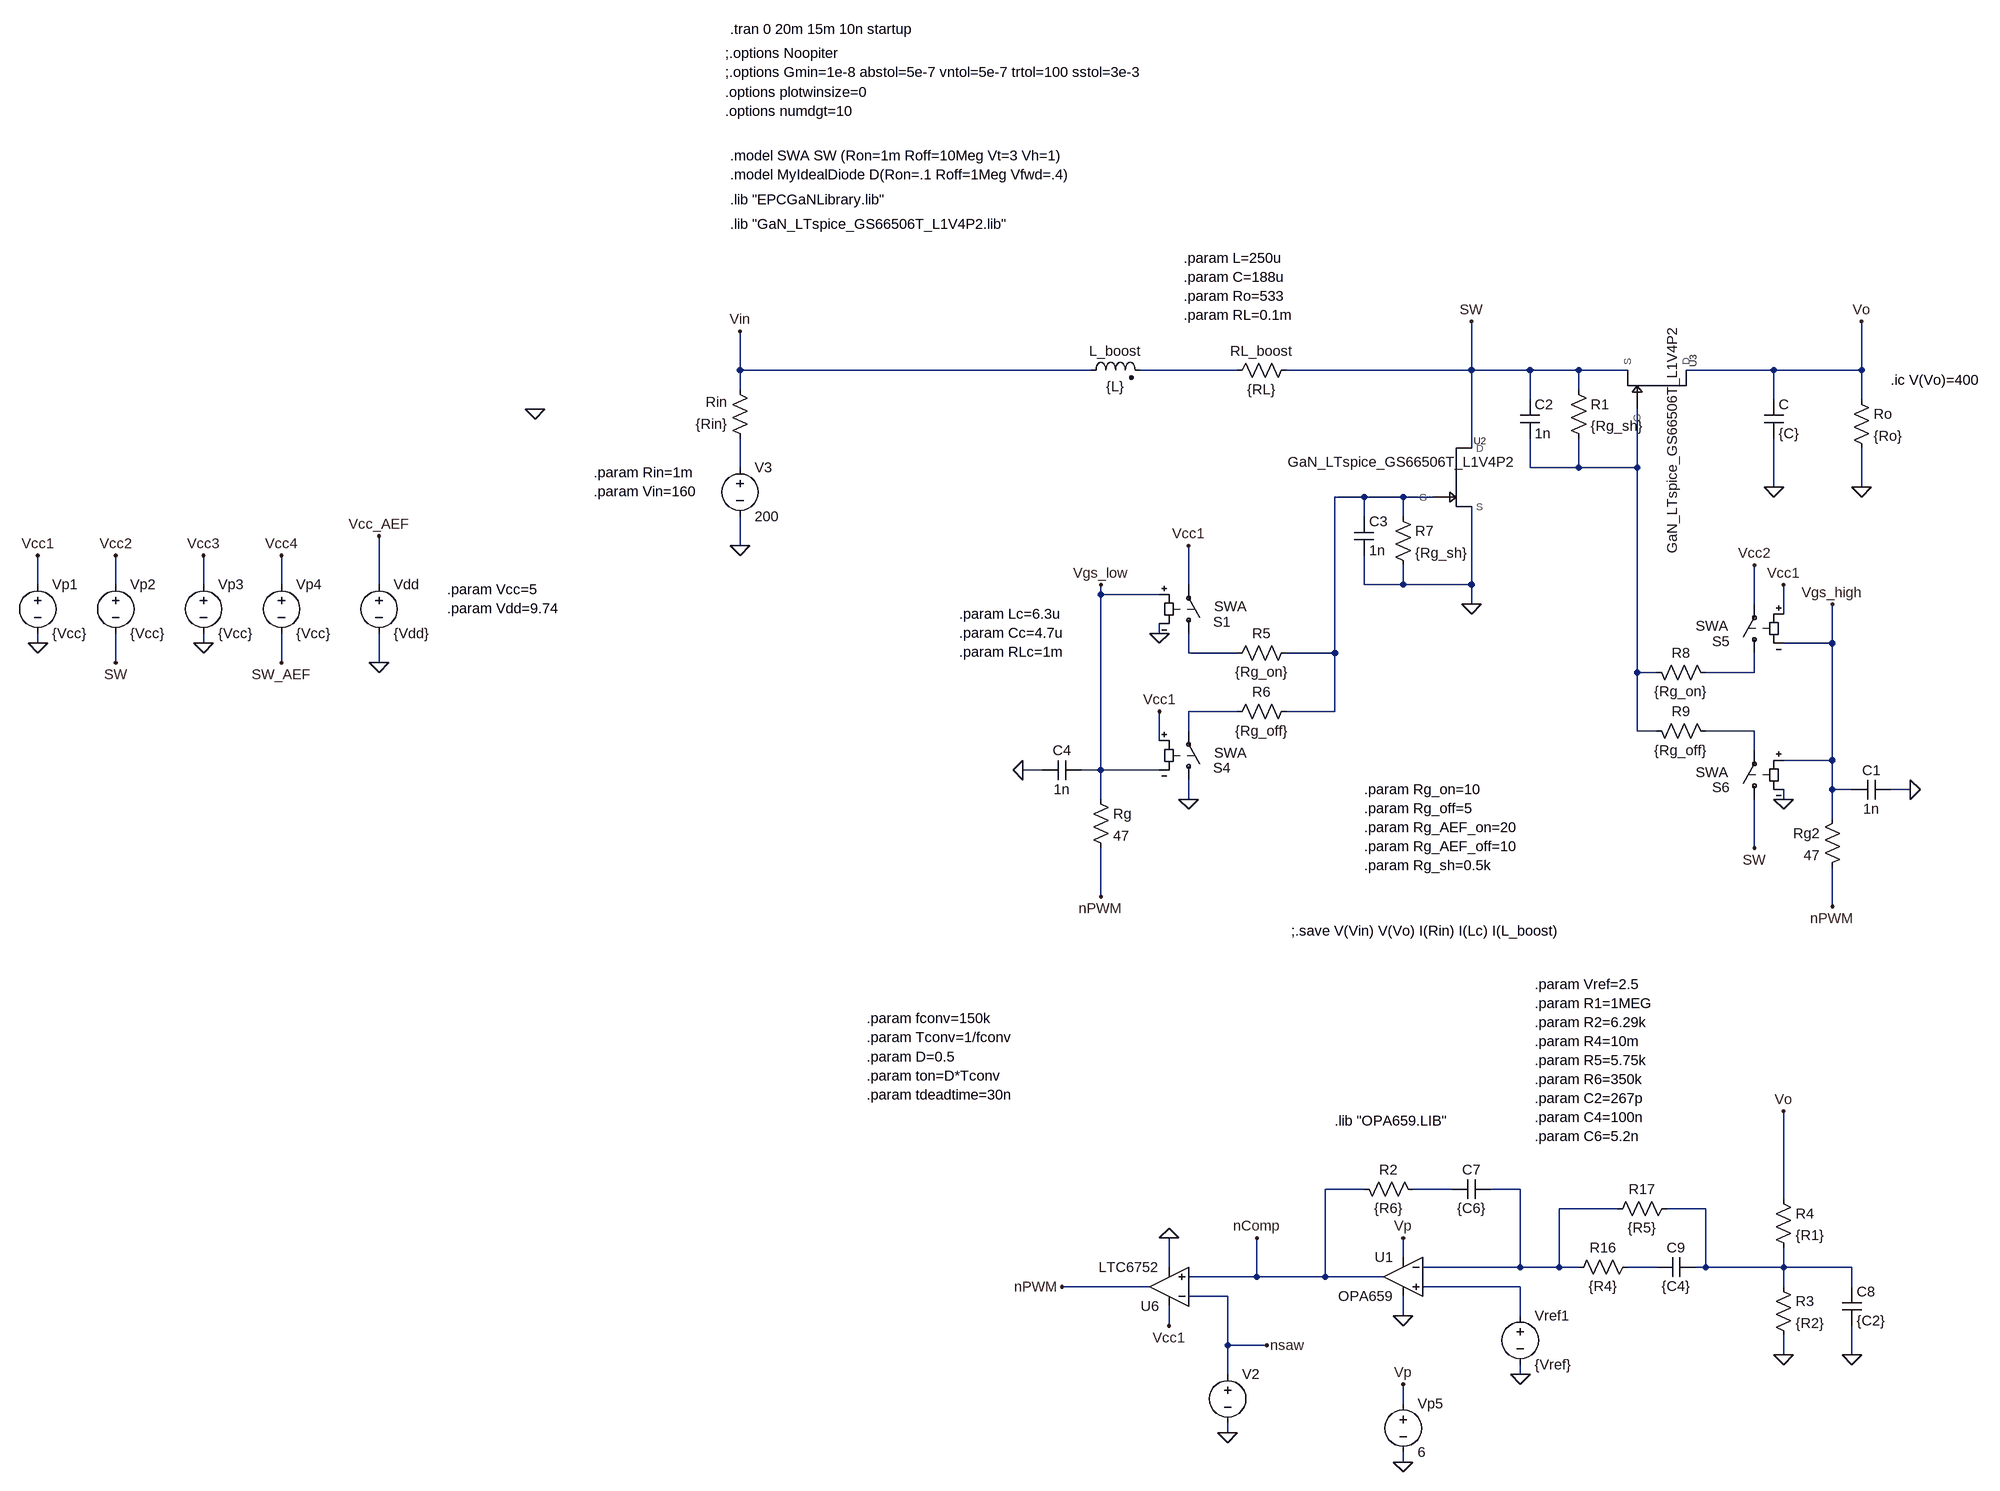
[diagram p0: schematic Boost converter with LC filter -20221025.asc]
Boost converter with LC filter -20221025.asc, the LTspice schematic file:
Version 4
SHEET 1 4440 3892
WIRE -1056 640 -1056 576
WIRE -480 640 -1056 640
WIRE -240 640 -400 640
WIRE 144 640 144 560
WIRE 144 640 -160 640
WIRE 240 640 144 640
WIRE 320 640 240 640
WIRE 400 640 320 640
WIRE 640 640 496 640
WIRE 784 640 784 560
WIRE 784 640 640 640
WIRE -1056 672 -1056 640
WIRE 320 672 320 640
WIRE 240 688 240 640
WIRE 640 688 640 640
WIRE 784 688 784 640
WIRE 144 768 144 640
WIRE -1056 800 -1056 752
WIRE 240 800 240 752
WIRE 320 800 320 752
WIRE 320 800 240 800
WIRE 416 800 416 704
WIRE 416 800 320 800
WIRE 640 832 640 752
WIRE 784 832 784 768
WIRE -32 848 -80 848
WIRE 32 848 -32 848
WIRE 80 848 32 848
WIRE -32 880 -32 848
WIRE 32 880 32 848
WIRE -1056 928 -1056 880
WIRE -2208 992 -2208 944
WIRE -2080 992 -2080 944
WIRE -1936 992 -1936 944
WIRE -1808 992 -1808 944
WIRE -1648 992 -1648 912
WIRE -320 992 -320 928
WIRE -32 992 -32 944
WIRE 32 992 32 960
WIRE 32 992 -32 992
WIRE 144 992 144 864
WIRE 144 992 32 992
WIRE -464 1008 -464 992
WIRE -368 1008 -464 1008
WIRE 144 1024 144 992
WIRE 608 1024 608 960
WIRE 656 1040 656 992
WIRE -368 1072 -368 1056
WIRE -2208 1088 -2208 1072
WIRE -1936 1088 -1936 1072
WIRE 736 1088 736 1024
WIRE 736 1088 656 1088
WIRE -320 1104 -320 1072
WIRE -240 1104 -320 1104
WIRE -80 1104 -80 848
WIRE -80 1104 -160 1104
WIRE -2080 1120 -2080 1072
WIRE -1808 1120 -1808 1072
WIRE -1648 1120 -1648 1072
WIRE 416 1136 416 800
WIRE 448 1136 416 1136
WIRE 608 1136 608 1104
WIRE 608 1136 528 1136
WIRE -240 1200 -320 1200
WIRE -80 1200 -80 1104
WIRE -80 1200 -160 1200
WIRE -320 1232 -320 1200
WIRE 416 1232 416 1136
WIRE 448 1232 416 1232
WIRE 608 1232 528 1232
WIRE -368 1248 -368 1200
WIRE 608 1264 608 1232
WIRE 736 1280 736 1088
WIRE 736 1280 656 1280
WIRE -560 1296 -592 1296
WIRE -464 1296 -464 1008
WIRE -464 1296 -496 1296
WIRE -368 1296 -464 1296
WIRE 736 1328 736 1280
WIRE 768 1328 736 1328
WIRE 864 1328 832 1328
WIRE -464 1344 -464 1296
WIRE -320 1344 -320 1312
WIRE 656 1344 656 1328
WIRE 736 1376 736 1328
WIRE 608 1424 608 1344
WIRE -464 1504 -464 1424
WIRE 736 1520 736 1456
WIRE -32 1984 -96 1984
WIRE 112 1984 48 1984
WIRE 224 1984 176 1984
WIRE 656 2000 656 1856
WIRE 384 2016 288 2016
WIRE 528 2016 464 2016
WIRE 32 2096 32 2064
WIRE -352 2112 -352 2064
WIRE 224 2112 224 1984
WIRE 224 2112 64 2112
WIRE 288 2112 288 2016
WIRE 288 2112 224 2112
WIRE 320 2112 288 2112
WIRE 448 2112 400 2112
WIRE 528 2112 528 2016
WIRE 528 2112 512 2112
WIRE 656 2112 656 2080
WIRE 656 2112 528 2112
WIRE 768 2112 656 2112
WIRE -208 2128 -208 2064
WIRE -208 2128 -320 2128
WIRE -96 2128 -96 1984
WIRE -96 2128 -208 2128
WIRE 0 2128 -96 2128
WIRE -384 2144 -528 2144
WIRE 224 2144 64 2144
WIRE 656 2144 656 2112
WIRE 768 2144 768 2112
WIRE -256 2160 -320 2160
WIRE 32 2192 32 2160
WIRE 224 2192 224 2144
WIRE -352 2208 -352 2176
WIRE -256 2240 -256 2160
WIRE -192 2240 -256 2240
WIRE 656 2256 656 2224
WIRE 768 2256 768 2208
WIRE -256 2288 -256 2240
WIRE 224 2288 224 2272
WIRE 32 2336 32 2304
WIRE -256 2384 -256 2368
WIRE 32 2432 32 2416
FLAG -1056 928 0
FLAG -368 1072 0
FLAG 640 832 0
FLAG 784 832 0
FLAG -1056 576 Vin
FLAG -464 992 Vgs_low
FLAG 784 560 Vo
FLAG -1648 1120 0
FLAG -1648 912 Vcc_AEF
FLAG -2208 1088 0
FLAG -464 1504 nPWM
FLAG 144 1024 0
FLAG 144 560 SW
FLAG -2208 944 Vcc1
FLAG -2080 944 Vcc2
FLAG -1936 1088 0
FLAG -1936 944 Vcc3
FLAG -1808 944 Vcc4
FLAG -320 928 Vcc1
FLAG -320 1344 0
FLAG 736 1024 Vgs_high
FLAG 736 1520 nPWM
FLAG 608 960 Vcc2
FLAG 608 1424 SW
FLAG -2080 1120 SW
FLAG -1808 1120 SW_AEF
FLAG 864 1328 0
FLAG 656 992 Vcc1
FLAG -368 1200 Vcc1
FLAG -592 1296 0
FLAG 656 1344 0
FLAG 224 2288 0
FLAG 656 2256 0
FLAG 656 1856 Vo
FLAG 32 2432 0
FLAG 32 2304 Vp
FLAG 32 2064 Vp
FLAG 32 2192 0
FLAG 768 2256 0
FLAG -192 2240 nsaw
FLAG -256 2384 0
FLAG -208 2064 nComp
FLAG -352 2208 Vcc1
FLAG -352 2064 0
FLAG -528 2144 nPWM
FLAG -1392 704 0
SYMBOL ind2 -496 656 R270
WINDOW 0 32 56 VTop 2
WINDOW 3 5 56 VBottom 2
SYMATTR InstName L_boost
SYMATTR Value {L}
SYMATTR Type ind
SYMBOL res -1040 768 R180
WINDOW 0 36 76 Left 2
WINDOW 3 36 40 Left 2
SYMATTR InstName Rin
SYMATTR Value {Rin}
SYMBOL sw -320 1088 M180
WINDOW 0 40 35 Left 2
WINDOW 3 42 60 Left 2
SYMATTR InstName S1
SYMATTR Value SWA
SYMBOL cap 624 688 R0
SYMATTR InstName C
SYMATTR Value {C}
SYMBOL res 768 672 R0
SYMATTR InstName Ro
SYMATTR Value {Ro}
SYMBOL res -480 1328 R0
SYMATTR InstName Rg
SYMATTR Value 47
SYMBOL voltage -1648 976 R0
WINDOW 123 0 0 Left 2
WINDOW 39 0 0 Left 2
SYMATTR InstName Vdd
SYMATTR Value {Vdd}
SYMBOL voltage -2208 976 R0
WINDOW 123 0 0 Left 2
WINDOW 39 0 0 Left 2
SYMATTR InstName Vp1
SYMATTR Value {Vcc}
SYMBOL GaN_LTspice_GS66506T_L1V4P2 96 816 R0
SYMATTR InstName U2
SYMBOL GaN_LTspice_GS66506T_L1V4P2 448 688 M270
SYMATTR InstName U3
SYMBOL voltage -2080 976 R0
WINDOW 123 0 0 Left 2
WINDOW 39 0 0 Left 2
SYMATTR InstName Vp2
SYMATTR Value {Vcc}
SYMBOL voltage -1936 976 R0
WINDOW 123 0 0 Left 2
WINDOW 39 0 0 Left 2
SYMATTR InstName Vp3
SYMATTR Value {Vcc}
SYMBOL voltage -1808 976 R0
WINDOW 123 0 0 Left 2
WINDOW 39 0 0 Left 2
SYMATTR InstName Vp4
SYMATTR Value {Vcc}
SYMBOL res -144 1088 R90
WINDOW 0 0 56 VBottom 2
WINDOW 3 32 56 VTop 2
SYMATTR InstName R5
SYMATTR Value {Rg_on}
SYMBOL sw -320 1328 M180
WINDOW 0 40 35 Left 2
WINDOW 3 42 60 Left 2
SYMATTR InstName S4
SYMATTR Value SWA
SYMBOL res -144 1184 R90
WINDOW 0 0 56 VBottom 2
WINDOW 3 32 56 VTop 2
SYMATTR InstName R6
SYMATTR Value {Rg_off}
SYMBOL res 16 864 R0
SYMATTR InstName R7
SYMATTR Value {Rg_sh}
SYMBOL sw 608 1120 R180
WINDOW 0 40 35 Left 2
WINDOW 3 42 60 Left 2
SYMATTR InstName S5
SYMATTR Value SWA
SYMBOL res 752 1360 M0
SYMATTR InstName Rg2
SYMATTR Value 47
SYMBOL res 432 1120 M90
WINDOW 0 0 56 VBottom 2
WINDOW 3 32 56 VTop 2
SYMATTR InstName R8
SYMATTR Value {Rg_on}
SYMBOL sw 608 1360 R180
WINDOW 0 40 35 Left 2
WINDOW 3 42 60 Left 2
SYMATTR InstName S6
SYMATTR Value SWA
SYMBOL res 432 1216 M90
WINDOW 0 0 56 VBottom 2
WINDOW 3 32 56 VTop 2
SYMATTR InstName R9
SYMATTR Value {Rg_off}
SYMBOL res 304 656 R0
SYMATTR InstName R1
SYMATTR Value {Rg_sh}
SYMBOL res -144 624 R90
WINDOW 0 0 56 VBottom 2
WINDOW 3 32 56 VTop 2
SYMATTR InstName RL_boost
SYMATTR Value {RL}
SYMBOL cap 832 1312 R90
WINDOW 0 0 32 VBottom 2
WINDOW 3 32 32 VTop 2
SYMATTR InstName C1
SYMATTR Value 1n
SYMBOL cap 224 688 R0
SYMATTR InstName C2
SYMATTR Value 1n
SYMBOL cap -48 880 R0
SYMATTR InstName C3
SYMATTR Value 1n
SYMBOL cap -496 1280 R90
WINDOW 0 0 32 VBottom 2
WINDOW 3 32 32 VTop 2
SYMATTR InstName C4
SYMATTR Value 1n
SYMBOL res -48 1968 M90
WINDOW 0 0 56 VBottom 2
WINDOW 3 32 56 VTop 2
SYMATTR InstName R2
SYMATTR Value {R6}
SYMBOL cap 176 1968 R90
WINDOW 0 0 32 VBottom 2
WINDOW 3 32 32 VTop 2
SYMATTR InstName C7
SYMATTR Value {C6}
SYMBOL voltage 224 2176 R0
SYMATTR InstName Vref1
SYMATTR Value {Vref}
SYMBOL res 640 2128 R0
SYMATTR InstName R3
SYMATTR Value {R2}
SYMBOL cap 752 2144 R0
SYMATTR InstName C8
SYMATTR Value {C2}
SYMBOL res 640 1984 R0
SYMATTR InstName R4
SYMATTR Value {R1}
SYMBOL OPA659 32 2064 M0
SYMATTR InstName U1
SYMBOL voltage 32 2320 R0
WINDOW 123 0 0 Left 2
WINDOW 39 0 0 Left 2
SYMATTR InstName Vp5
SYMATTR Value 6
SYMBOL res 416 2096 R90
WINDOW 0 0 56 VBottom 2
WINDOW 3 32 56 VTop 2
SYMATTR InstName R16
SYMATTR Value {R4}
SYMBOL cap 512 2096 R90
WINDOW 0 0 32 VBottom 2
WINDOW 3 32 32 VTop 2
SYMATTR InstName C9
SYMATTR Value {C4}
SYMBOL res 480 2000 R90
WINDOW 0 0 56 VBottom 2
WINDOW 3 32 56 VTop 2
SYMATTR InstName R17
SYMATTR Value {R5}
SYMBOL voltage -256 2272 R0
WINDOW 3 -712 59 Invisible 2
SYMATTR Value PWL repeat forever (0 0 {3.33u} 5 {6.66u} 0) endrepeat
SYMATTR InstName V2
SYMBOL Comparators\\LTC6752 -352 2208 R180
SYMATTR InstName U6
SYMBOL voltage -1056 784 R0
WINDOW 123 0 0 Left 0
WINDOW 39 0 0 Left 0
SYMATTR InstName V3
SYMATTR Value 200
TEXT -848 1704 Left 2 !.param fconv=150k \n.param Tconv=1/fconv\n.param D=0.5\n.param ton=D*Tconv\n.param tdeadtime=30n
TEXT -1080 120 Left 2 !;.options Noopiter\n;.options Gmin=1e-8 abstol=5e-7 vntol=5e-7 trtol=100 sstol=3e-3
TEXT -1072 80 Left 2 !.tran 0 20m 15m 10n startup
TEXT -1080 184 Left 2 !.options plotwinsize=0\n.options numdgt=10
TEXT -1072 288 Left 2 !.model SWA SW (Ron=1m Roff=10Meg Vt=3 Vh=1)\n.model MyIdealDiode D(Ron=.1 Roff=1Meg Vfwd=.4)
TEXT -1296 808 Left 2 !.param Rin=1m\n.param Vin=160
TEXT -328 456 Left 2 !.param L=250u\n.param C=188u\n.param Ro=533\n.param RL=0.1m
TEXT 832 656 Left 2 !.ic V(Vo)=400
TEXT -1072 360 Left 2 !.lib "EPCGaNLibrary.lib"
TEXT -1072 400 Left 2 !.lib "GaN_LTspice_GS66506T_L1V4P2.lib"
TEXT -1536 1000 Left 2 !.param Vcc=5\n.param Vdd=9.74
TEXT -32 1328 Left 2 !.param Rg_on=10\n.param Rg_off=5\n.param Rg_AEF_on=20\n.param Rg_AEF_off=10\n.param Rg_sh=0.5k
TEXT -696 1040 Left 2 !.param Lc=6.3u\n.param Cc=4.7u\n.param RLc=1m
TEXT -80 1872 Left 2 !.lib "OPA659.LIB"
TEXT 248 1648 Left 2 !.param Vref=2.5\n.param R1=1MEG\n.param R2=6.29k\n.param R4=10m\n.param R5=5.75k\n.param R6=350k\n.param C2=267p\n.param C4=100n\n.param C6=5.2n
TEXT -152 1560 Left 2 !;.save V(Vin) V(Vo) I(Rin) I(Lc) I(L_boost)

The netlist it stands for:
* Boost converter with LC filter -20221025.asc
L_boost Vin N001 {L}
Rin N002 Vin {Rin}
S1 N005 Vcc1 Vgs_low 0 SWA
C Vo 0 {C}
Ro Vo 0 {Ro}
Rg Vgs_low nPWM 47
Vdd Vcc_AEF 0 {Vdd}
Vp1 Vcc1 0 {Vcc}
XU2 N004 SW 0 GaN_LTspice_GS66506T_L1V4P2  ; pins G D S
XU3 N003 Vo SW GaN_LTspice_GS66506T_L1V4P2  ; pins G D S
Vp2 Vcc2 SW {Vcc}
Vp3 Vcc3 0 {Vcc}
Vp4 Vcc4 SW_AEF {Vcc}
R5 N004 N005 {Rg_on}
S4 0 N007 Vcc1 Vgs_low SWA
R6 N004 N007 {Rg_off}
R7 N004 0 {Rg_sh}
S5 N006 Vcc2 Vcc1 Vgs_high SWA
Rg2 Vgs_high nPWM 47
R8 N003 N006 {Rg_on}
S6 SW N008 Vgs_high 0 SWA
R9 N003 N008 {Rg_off}
R1 SW N003 {Rg_sh}
RL_boost SW N001 {RL}
C1 0 Vgs_high 1n
C2 SW N003 1n
C3 N004 0 1n
C4 Vgs_low 0 1n
R2 nComp N009 {R6}
C7 N010 N009 {C6}
Vref1 N013 0 {Vref}
R3 N011 0 {R2}
C8 N011 0 {C2}
R4 Vo N011 {R1}
* U1: OPA659 (symbol OPA659 not available, pins judged from their places): In+=N013 In-=N010 V+=Vp V-=0 OUT=nComp
Vp5 Vp 0 6
R16 N012 N010 {R4}
C9 N011 N012 {C4}
R17 N011 N010 {R5}
V2 nsaw 0 PWL repeat forever (0 0 {3.33u} 5 {6.66u} 0) endrepeat
XU6 nComp nsaw Vcc1 0 nPWM LTC6752  ; pins In+ In- V+ V- OUT
V3 N002 0 200
.param fconv=150k
.param Tconv=1/fconv
.param D=0.5
.param ton=D*Tconv
.param tdeadtime=30n
;.options Noopiter
;.options Gmin=1e-8 abstol=5e-7 vntol=5e-7 trtol=100 sstol=3e-3
.tran 0 20m 15m 10n startup
.options plotwinsize=0
.options numdgt=10
.model SWA SW (Ron=1m Roff=10Meg Vt=3 Vh=1)
.model MyIdealDiode D(Ron=.1 Roff=1Meg Vfwd=.4)
.param Rin=1m
.param Vin=160
.param L=250u
.param C=188u
.param Ro=533
.param RL=0.1m
.ic V(Vo)=400
.lib "EPCGaNLibrary.lib"
.lib "GaN_LTspice_GS66506T_L1V4P2.lib"
.param Vcc=5
.param Vdd=9.74
.param Rg_on=10
.param Rg_off=5
.param Rg_AEF_on=20
.param Rg_AEF_off=10
.param Rg_sh=0.5k
.param Lc=6.3u
.param Cc=4.7u
.param RLc=1m
.lib "OPA659.LIB"
.param Vref=2.5
.param R1=1MEG
.param R2=6.29k
.param R4=10m
.param R5=5.75k
.param R6=350k
.param C2=267p
.param C4=100n
.param C6=5.2n
;.save V(Vin) V(Vo) I(Rin) I(Lc) I(L_boost)
.lib GaN_LTspice_GS66506T_L1V4P2.lib
.lib LTC7.lib
.backanno
.end